# EAGLE schematic usbjtag (EAGLE 7.2.0)
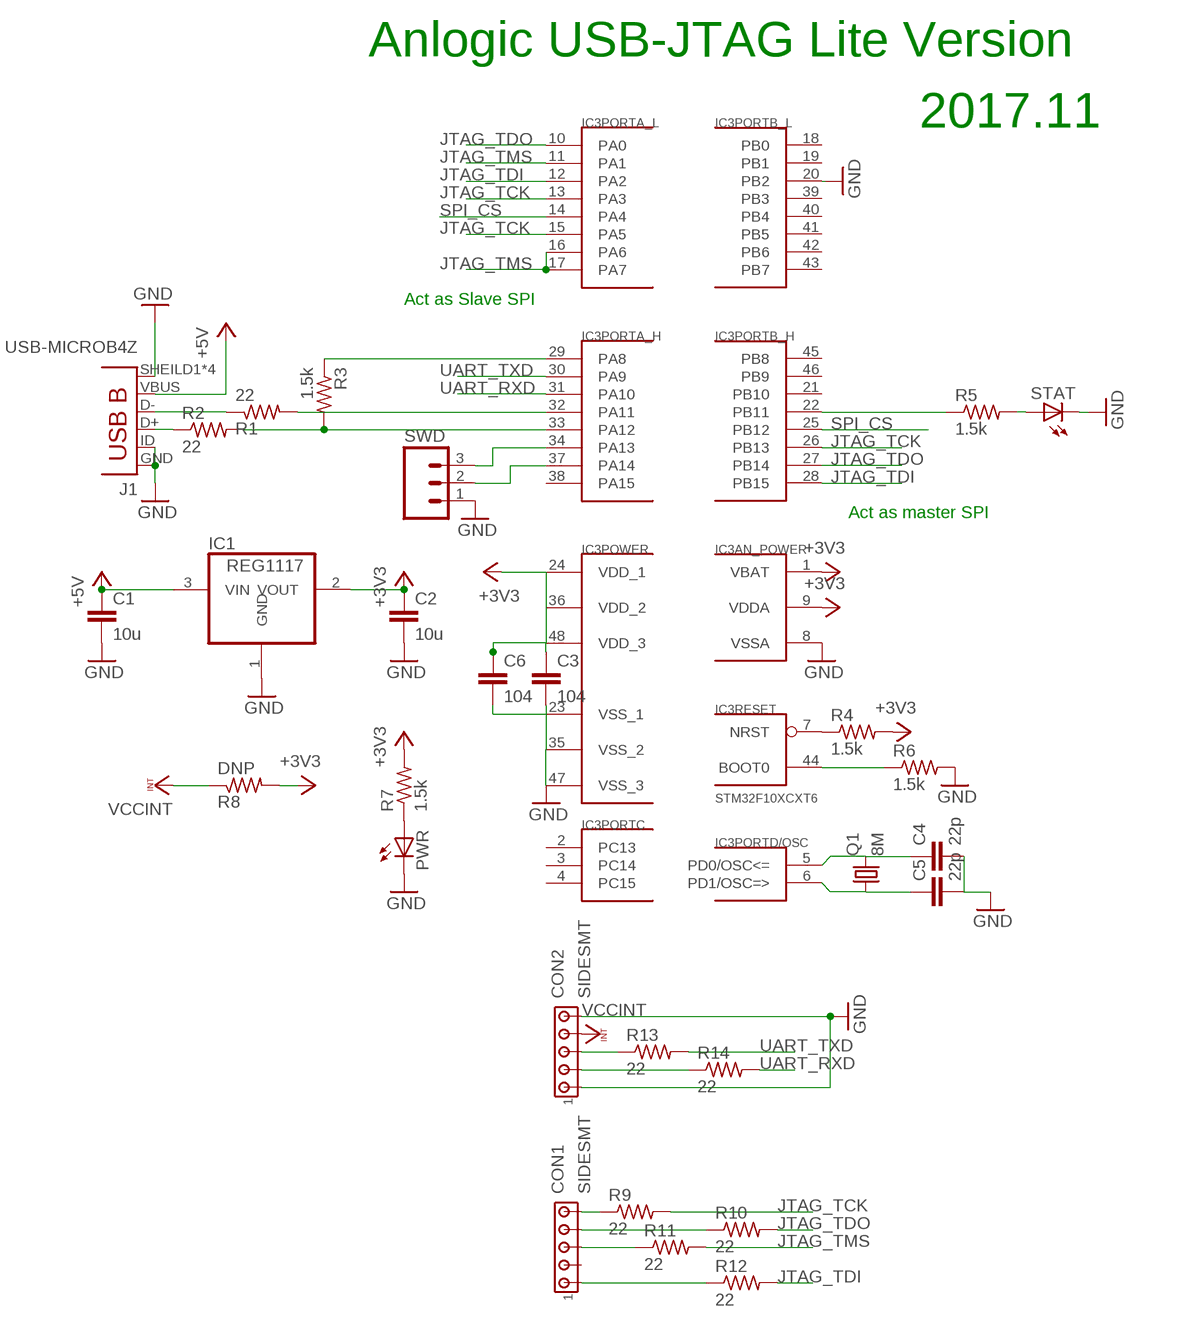
[diagram p0: schematic, sheet 1]

## Parts
C1  10u  C-EUC0805  [C0805]
C2  10u  C-EUC0805  [C0805]
C3  104  C-EUC0805  [C0805]
C4  22p  C-EUC0805  [C0805]
C5  22p  C-EUC0805  [C0805]
C6  104  C-EUC0805  [C0805]
CON1  SIDESMT  [SIDESMT]
CON2  SIDESMT  [SIDESMT]
IC1  REG1117  [SOT223]
IC3  STM32F10XCXT6  [TQFP48]
J1  USB-MICROB4Z  [MICROUSB_4Z]
PWR  LEDCHIP-LED0805  [CHIP-LED0805]
Q1  8M  CRYSTALHC49S  [HC49/S]
R1  22  R-US_M0805  [M0805]
R2  22  R-US_M0805  [M0805]
R3  1.5k  R-US_M0805  [M0805]
R4  1.5k  R-US_M0805  [M0805]
R5  1.5k  R-US_M0805  [M0805]
R6  1.5k  R-US_M0805  [M0805]
R7  1.5k  R-US_M0805  [M0805]
R8  DNP  R-US_M0805  [M0805]
R9  22  R-US_M0805  [M0805]
R10  22  R-US_M0805  [M0805]
R11  22  R-US_M0805  [M0805]
R12  22  R-US_M0805  [M0805]
R13  22  R-US_M0805  [M0805]
R14  22  R-US_M0805  [M0805]
STAT  LEDCHIP-LED0805  [CHIP-LED0805]
SWD  M03PTH  [1X03]

## Nets
+3V3: C2.1 C3.1 C6.1 IC1.2(VOUT) IC3.1(AN_POWER:VBAT) IC3.9(AN_POWER:VDDA) IC3.24(POWER:VDD_1) IC3.36(POWER:VDD_2) IC3.48(POWER:VDD_3) R4.2 R7.2 R8.2
+5V: C1.1 IC1.3(VIN) J1.VBUS
GND [gnd]: C1.2 C2.2 C3.2 C4.2 C5.2 C6.2 CON2.1 CON2.5 IC1.1(GND) IC3.8(AN_POWER:VSSA) IC3.20(PORTB_L:PB2) IC3.23(POWER:VSS_1) IC3.35(POWER:VSS_2) IC3.47(POWER:VSS_3) J1.GND J1.ID(USBID) J1.SHEILD1(SHIELD) J1.SHEILD2(SHIELD) J1.SHEILD3(SHIELD) J1.SHEILD4(SHIELD) PWR.C R6.2 STAT.C SWD.1
JTAG_TCK: IC3.13(PORTA_L:PA3) IC3.15(PORTA_L:PA5) IC3.26(PORTB_H:PB13) R9.2
JTAG_TDI: IC3.12(PORTA_L:PA2) IC3.28(PORTB_H:PB15) R12.2
JTAG_TDO: IC3.10(PORTA_L:PA0) IC3.27(PORTB_H:PB14) R10.2
JTAG_TMS: IC3.11(PORTA_L:PA1) IC3.16(PORTA_L:PA6) IC3.17(PORTA_L:PA7) R11.2
N$1: J1.D- R1.1
N$2: J1.D+ R2.1
N$3: IC3.34(PORTA_H:PA13) SWD.3
N$4: PWR.A R7.1
N$5: IC3.37(PORTA_H:PA14) SWD.2
N$6: CON1.5 R9.1
N$7: CON2.3 R13.1
N$8: CON1.4 R10.1
N$9: CON2.2 R14.1
N$10: CON1.3 R11.1
N$12: CON1.1 R12.1
N$27: IC3.32(PORTA_H:PA11) R1.2
N$28: IC3.33(PORTA_H:PA12) R2.2 R3.2
N$29: IC3.29(PORTA_H:PA8) R3.1
N$32: IC3.7(RESET:NRST) R4.1
N$33: IC3.22(PORTB_H:PB11) R5.1
N$34: R5.2 STAT.A
N$35: C4.1 IC3.5(PORTD/OSC:PD0/OSC<=) Q1.2
N$36: C5.1 IC3.6(PORTD/OSC:PD1/OSC=>) Q1.1
N$37: IC3.44(RESET:BOOT0) R6.1
SPI_CS: IC3.14(PORTA_L:PA4) IC3.25(PORTB_H:PB12)
UART_RXD: IC3.31(PORTA_H:PA10) R14.2
UART_TXD: IC3.30(PORTA_H:PA9) R13.2
VCCINT: CON2.4 R8.1
Unconnected: CON1.2 IC3.2(PORTC:PC13) IC3.3(PORTC:PC14) IC3.4(PORTC:PC15) IC3.18(PORTB_L:PB0) IC3.19(PORTB_L:PB1) IC3.21(PORTB_H:PB10) IC3.38(PORTA_H:PA15) IC3.39(PORTB_L:PB3) IC3.40(PORTB_L:PB4) IC3.41(PORTB_L:PB5) IC3.42(PORTB_L:PB6) IC3.43(PORTB_L:PB7) IC3.45(PORTB_H:PB8) IC3.46(PORTB_H:PB9)

## Notes on the sheet
- Anlogic USB-JTAG Lite Version
- 2017.11
- Act as Slave SPI
- Act as master SPI

## Library data of the parts
C1-C6 = rcl:C-EU: CAPACITOR, European symbol
CON1 CON2 = con-amp:SIDESMT
IC1 = burr-brown:REG1117: 800mA and 1A Low Dropout (LDO) Positive Regulator 1.8V, 2.5V, 2.85V, 3.3V, 5V, and Adj; MPN: REG1117; OC_FARNELL: 1097566; OC_NEWARK: 14P6981
IC3 = stm32:STM32F10XCXT6: ST STM32F101/103 48pin LQFP
J1 = SparkFun-Connectors:USB-MICROB
PWR STAT = led:LED: LED OSRAM: - CHIPLED LG R971, LG N971, LY N971, LG Q971, LY Q971, LO R971, LY R971 LH N974, LH R974 LS Q976, LO Q976, LY Q976 LO Q996 - Hyper CHIPLED LW Q18S LB Q993, LB Q99A, LB R99A - SideLED LS A670, LO A670, LY A670, LG A670, LP A670 LB A673, LV A673, LT A673, LW A673 LH A674 LY A675 LS A676, LA A676, LO A676, LY A676, LW A676 LS A679, LY A679, LG A679 - Hyper Micro SIDELED® LS Y876, LA Y876, LO Y876, LY Y876 LT Y87S - SmartLED LW L88C, LW L88S LB L89C, LB L89S, LG L890 LS L89K, LO L89K, LY L89K LS L896, LA L896, LO L896, LY L896 - TOPLED LS T670, LO T670, LY T670, LG T670, LP T670 LSG T670, LSP T670, LSY T670, LOP T670, LYG T670 LG T671, LOG T671, LSG T671 LB T673, LV T673, LT T673, LW T673 LH T674 LS T676, LA T676, LO T676, LY T676, LB T676, LH T676, LSB T676, LW T676 LB T67C, LV T67C, LT T67C, LS T67K, LO T67K, LY T67K, LW E67C LS E67B, LA E67B, LO E67B, LY E67B, LB E67C, LV E67C, LT E67C LW T67C LS T679, LY T679, LG T679 LS T770, LO T770, LY T770, LG T770, LP T770 LB T773, LV T773, LT T773, LW T773 LH T774 LS E675, LA E675, LY E675, LS T675 LS T776, LA T776, LO T776, LY T776, LB T776 LHGB T686 LT T68C, LB T68C - Hyper Mini TOPLED® LB M676 - Mini TOPLED Santana® LG M470 LS M47K, LO M47K, LY M47K Source: http://www.osram.convergy.de LUXEON: - LUMILED® LXK2-PW12-R00, LXK2-PW12-S00, LXK2-PW14-U00, LXK2-PW14-V00 LXK2-PM12-R00, LXK2-PM12-S00, LXK2-PM14-U00 LXK2-PE12-Q00, LXK2-PE12-R00, LXK2-PE12-S00, LXK2-PE14-T00, LXK2-PE14-U00 LXK2-PB12-K00, LXK2-PB12-L00, LXK2-PB12-M00, LXK2-PB14-N00, LXK2-PB14-P00, LXK2-PB14-Q00 LXK2-PR12-L00, LXK2-PR12-M00, LXK2-PR14-Q00, LXK2-PR14-R00 LXK2-PD12-Q00, LXK2-PD12-R00, LXK2-PD12-S00 LXK2-PH12-R00, LXK2-PH12-S00 LXK2-PL12-P00, LXK2-PL12-Q00, LXK2-PL12-R00 Source: www.luxeon.com KINGBRIGHT: KA-3528ASYC Source: www.kingbright.com
Q1 = crystal:CRYSTAL: CRYSTAL; OC_FARNELL: 1667008; OC_NEWARK: unknown
R1-R14 = rcl:R-US_: RESISTOR, American symbol
SWD = SparkFun-Connectors:M03: Header 3 Standard 3-pin 0.1" header. Use with straight break away headers (SKU : PRT-00116), right angle break away headers (PRT-00553), swiss pins (PRT-00743), machine pins (PRT-00117), and female headers (PRT-00115). Molex polarized connector foot print use with SKU : PRT-08232 with associated crimp pins and housings.

## Net classes
0 default: width 0.254 mm, clearance 0.254 mm
2 gnd: width 0.305 mm, drill 0.559 mm, clearance 0.254 mm
3 usbvcc: width 0.508 mm, drill 0.61 mm, clearance 0.254 mm